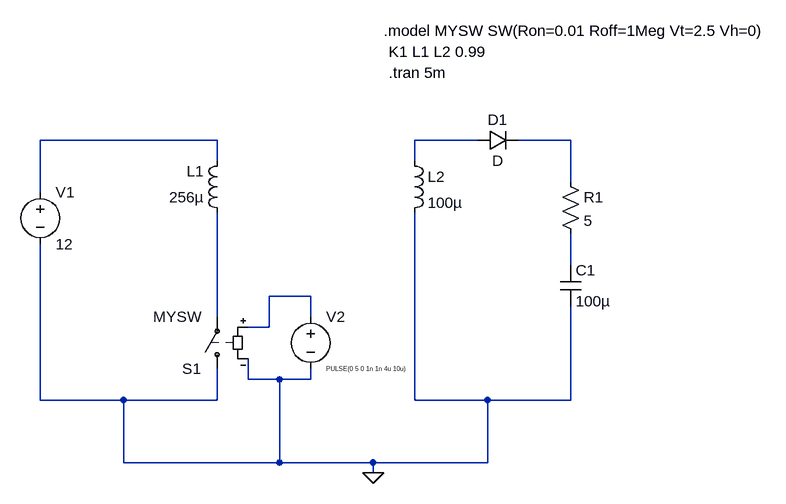
[diagram p0: schematic flyback_K099.asc]
flyback_K099.asc, the LTspice schematic file:
Version 4.1
SHEET 1 880 680
WIRE -256 64 -528 64
WIRE 144 64 48 64
WIRE 288 64 208 64
WIRE -256 96 -256 64
WIRE 48 96 48 64
WIRE 288 128 288 64
WIRE -528 144 -528 64
WIRE 288 256 288 208
WIRE -112 304 -176 304
WIRE -256 336 -256 176
WIRE -112 336 -112 304
WIRE -176 352 -176 304
WIRE -176 352 -208 352
WIRE -208 432 -208 400
WIRE -160 432 -208 432
WIRE -112 432 -112 416
WIRE -112 432 -160 432
WIRE -528 464 -528 224
WIRE -400 464 -528 464
WIRE -256 464 -256 416
WIRE -256 464 -400 464
WIRE 48 464 48 176
WIRE 160 464 48 464
WIRE 288 464 288 320
WIRE 288 464 160 464
WIRE -400 560 -400 464
WIRE -160 560 -160 432
WIRE -160 560 -400 560
WIRE -16 560 -160 560
WIRE 160 560 160 464
WIRE 160 560 -16 560
WIRE -16 576 -16 560
FLAG -16 576 0
SYMBOL res 272 112 R0
SYMATTR InstName R1
SYMATTR Value 5
SYMBOL cap 272 256 R0
SYMATTR InstName C1
SYMATTR Value 100µ
SYMBOL voltage -528 128 R0
WINDOW 123 0 0 Left 0
WINDOW 39 0 0 Left 0
SYMATTR InstName V1
SYMATTR Value 12
SYMBOL ind -240 192 R180
WINDOW 0 36 80 Left 2
WINDOW 3 36 40 Left 2
SYMATTR InstName L1
SYMATTR Value 256µ
SYMATTR Type ind
SYMBOL ind 32 80 R0
SYMATTR InstName L2
SYMATTR Value 100µ
SYMATTR Type ind
SYMBOL diode 144 80 R270
WINDOW 0 32 32 VTop 2
WINDOW 3 0 32 VBottom 2
SYMATTR InstName D1
SYMBOL sw -256 432 R180
SYMATTR InstName S1
SYMATTR Value MYSW
SYMBOL voltage -112 320 R0
WINDOW 3 24 96 Left 0
WINDOW 123 0 0 Left 0
WINDOW 39 0 0 Left 0
SYMATTR InstName V2
SYMATTR Value PULSE(0 5 0 1n 1n 4u 10u)
TEXT 0 -104 Left 2 !.model MYSW SW(Ron=0.01 Roff=1Meg Vt=2.5 Vh=0)
TEXT 8 -72 Left 2 !K1 L1 L2 0.99
TEXT 8 -40 Left 2 !.tran 5m

The netlist it stands for:
* flyback_K099.asc
R1 N003 N004 5
C1 N004 0 100µ
V1 N001 0 12
L1 N006 N001 256µ
L2 N002 0 100µ
D1 N002 N003 D
S1 0 N006 N005 0 MYSW
V2 N005 0 PULSE(0 5 0 1n 1n 4u 10u)
.model D D
.lib standard.dio
.model MYSW SW(Ron=0.01 Roff=1Meg Vt=2.5 Vh=0)
K1 L1 L2 0.99
.tran 5m
.backanno
.end